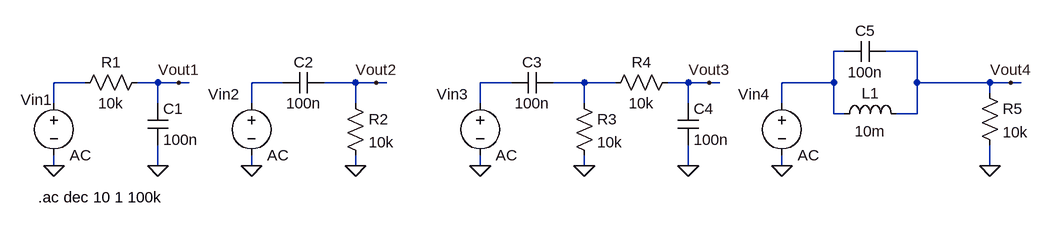
[diagram p0: schematic filtros.asc]
filtros.asc, the LTspice schematic file:
Version 4
SHEET 1 1316 680
WIRE 1008 80 992 80
WIRE 1120 80 1072 80
WIRE -160 128 -208 128
WIRE -48 128 -80 128
WIRE -16 128 -48 128
WIRE 0 128 -16 128
WIRE 144 128 96 128
WIRE 256 128 208 128
WIRE 288 128 256 128
WIRE 304 128 288 128
WIRE 496 128 448 128
WIRE 608 128 560 128
WIRE 656 128 608 128
WIRE 768 128 736 128
WIRE 800 128 768 128
WIRE 816 128 800 128
WIRE 992 128 992 80
WIRE 992 128 912 128
WIRE 1120 128 1120 80
WIRE 1232 128 1120 128
WIRE 1264 128 1232 128
WIRE 1280 128 1264 128
WIRE 1232 144 1232 128
WIRE -208 160 -208 128
WIRE -48 160 -48 128
WIRE 96 160 96 128
WIRE 256 160 256 128
WIRE 448 160 448 128
WIRE 608 160 608 128
WIRE 768 160 768 128
WIRE 912 160 912 128
WIRE 992 176 992 128
WIRE 1008 176 992 176
WIRE 1120 176 1120 128
WIRE 1120 176 1088 176
WIRE -208 256 -208 240
WIRE -48 256 -48 224
WIRE 96 256 96 240
WIRE 256 256 256 240
WIRE 448 256 448 240
WIRE 608 256 608 240
WIRE 768 256 768 224
WIRE 912 256 912 240
WIRE 1232 256 1232 224
FLAG -48 256 0
FLAG -208 256 0
FLAG -16 128 Vout1
FLAG 256 256 0
FLAG 96 256 0
FLAG 288 128 Vout2
FLAG 608 256 0
FLAG 448 256 0
FLAG 768 256 0
FLAG 800 128 Vout3
FLAG 912 256 0
FLAG 1232 256 0
FLAG 1264 128 Vout4
SYMBOL res -176 144 R270
WINDOW 0 32 56 VTop 2
WINDOW 3 0 56 VBottom 2
SYMATTR InstName R1
SYMATTR Value 10k
SYMBOL cap -64 160 R0
SYMATTR InstName C1
SYMATTR Value 100n
SYMBOL voltage -208 144 R0
WINDOW 0 -51 10 Left 2
SYMATTR InstName Vin1
SYMATTR Value AC
SYMBOL voltage 96 144 R0
WINDOW 0 -67 2 Left 2
SYMATTR InstName Vin2
SYMATTR Value AC
SYMBOL res 240 144 R0
SYMATTR InstName R2
SYMATTR Value 10k
SYMBOL cap 208 112 R90
WINDOW 0 0 32 VBottom 2
WINDOW 3 32 32 VTop 2
SYMATTR InstName C2
SYMATTR Value 100n
SYMBOL voltage 448 144 R0
WINDOW 0 -67 2 Left 2
SYMATTR InstName Vin3
SYMATTR Value AC
SYMBOL res 592 144 R0
SYMATTR InstName R3
SYMATTR Value 10k
SYMBOL cap 560 112 R90
WINDOW 0 0 32 VBottom 2
WINDOW 3 32 32 VTop 2
SYMATTR InstName C3
SYMATTR Value 100n
SYMBOL res 640 144 R270
WINDOW 0 32 56 VTop 2
WINDOW 3 0 56 VBottom 2
SYMATTR InstName R4
SYMATTR Value 10k
SYMBOL cap 752 160 R0
SYMATTR InstName C4
SYMATTR Value 100n
SYMBOL voltage 912 144 R0
WINDOW 0 -67 2 Left 2
SYMATTR InstName Vin4
SYMATTR Value AC
SYMBOL cap 1072 64 R90
WINDOW 0 0 32 VBottom 2
WINDOW 3 32 32 VTop 2
SYMATTR InstName C5
SYMATTR Value 100n
SYMBOL ind 992 192 R270
WINDOW 0 32 56 VTop 2
WINDOW 3 5 56 VBottom 2
SYMATTR InstName L1
SYMATTR Value 10m
SYMBOL res 1216 128 R0
SYMATTR InstName R5
SYMATTR Value 10k
TEXT -232 304 Left 2 !.ac dec 10 1 100k

The netlist it stands for:
* filtros.asc
R1 N002 Vout1 10k
C1 Vout1 0 100n
Vin1 N002 0 AC
Vin2 N003 0 AC
R2 Vout2 0 10k
C2 Vout2 N003 100n
Vin3 N004 0 AC
R3 N005 0 10k
C3 N005 N004 100n
R4 N005 Vout3 10k
C4 Vout3 0 100n
Vin4 N001 0 AC
C5 Vout4 N001 100n
L1 N001 Vout4 10m
R5 Vout4 0 10k
.ac dec 10 1 100k
.backanno
.end